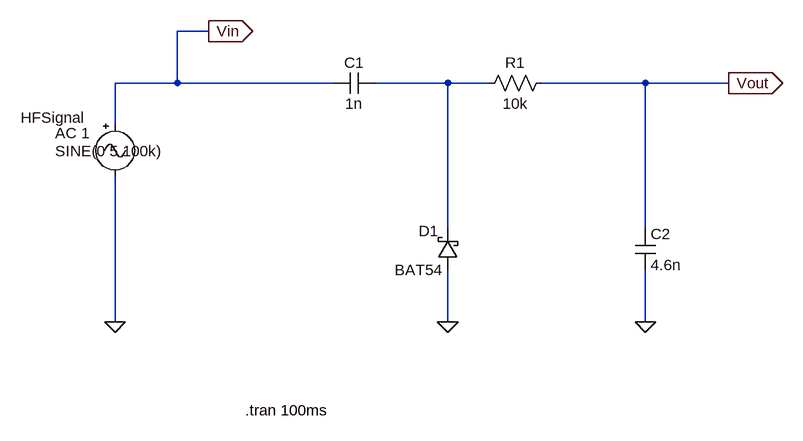
[diagram p0: schematic HF_Probe_HalfWaveRectifier.asc]
HF_Probe_HalfWaveRectifier.asc, the LTspice schematic file:
Version 4
SHEET 1 920 680
WIRE -928 -1504 -976 -1504
WIRE -976 -1424 -976 -1504
WIRE -976 -1424 -1072 -1424
WIRE -736 -1424 -976 -1424
WIRE -560 -1424 -672 -1424
WIRE -496 -1424 -560 -1424
WIRE -256 -1424 -416 -1424
WIRE -128 -1424 -256 -1424
WIRE -1072 -1360 -1072 -1424
WIRE -560 -1200 -560 -1424
WIRE -256 -1200 -256 -1424
WIRE -1072 -1056 -1072 -1280
WIRE -560 -1056 -560 -1136
WIRE -256 -1056 -256 -1136
FLAG -560 -1056 0
FLAG -1072 -1056 0
FLAG -256 -1056 0
FLAG -128 -1424 Vout
IOPIN -128 -1424 Out
FLAG -928 -1504 Vin
IOPIN -928 -1504 Out
SYMBOL Misc\\signal -1072 -1376 R0
WINDOW 123 -92 29 Left 2
WINDOW 39 0 0 Left 0
WINDOW 0 -145 5 Left 2
WINDOW 3 -92 57 Left 2
SYMATTR Value2 AC 1
SYMATTR InstName HFSignal
SYMATTR Value SINE(0 5 100k)
SYMBOL cap -272 -1200 R0
SYMATTR InstName C2
SYMATTR Value 4.6n
SYMBOL schottky -544 -1136 R180
WINDOW 0 30 60 Left 2
WINDOW 3 24 0 Left 2
SYMATTR InstName D1
SYMATTR Value BAT54
SYMATTR Description Diode
SYMATTR Type diode
SYMBOL res -400 -1440 R90
WINDOW 0 0 56 VBottom 2
WINDOW 3 32 56 VTop 2
SYMATTR InstName R1
SYMATTR Value 10k
SYMBOL cap -672 -1440 R90
WINDOW 0 0 32 VBottom 2
WINDOW 3 32 32 VTop 2
SYMATTR InstName C1
SYMATTR Value 1n
TEXT -872 -920 Left 2 !.tran 100ms

The netlist it stands for:
* HF_Probe_HalfWaveRectifier.asc
V§HFSignal Vin 0 SINE(0 5 100k) AC 1
C2 Vout 0 4.6n
D1 0 N001 BAT54
R1 Vout N001 10k
C1 N001 Vin 1n
.model D D
.lib standard.dio
.tran 100ms
.backanno
.end